# EAGLE design master_node_v0.1 (EAGLE 9.6.2)
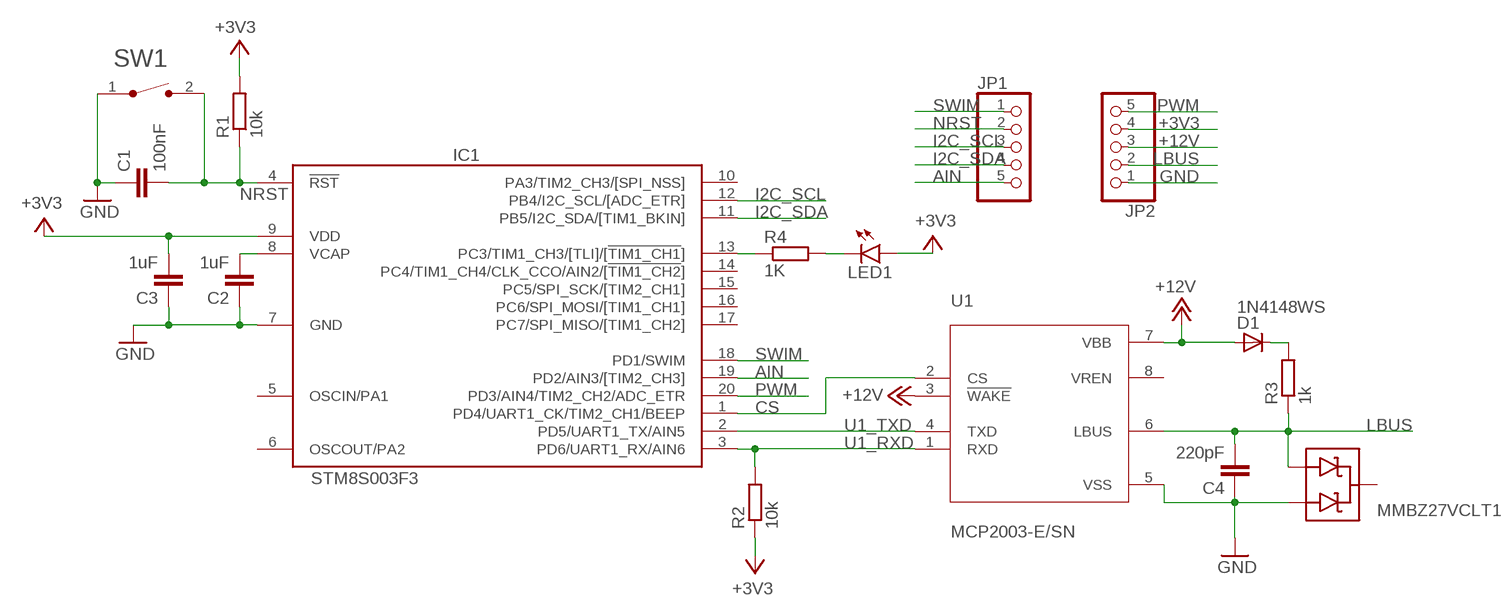
[diagram p0: schematic, sheet 1]

## Parts
C1  100nF  C-EUC0603  [C0603]
C2  1uF  C-EUC0603  [C0603]
C3  1uF  C-EUC0603  [C0603]
C4  220pF  C-EUC0603  [C0603]
D1  1N4148WS  [SOD323]
D2  MMBZ27VCLT1  [SOT23-3]
IC1  STM8S003F3  [TSSOP20]
JP1  PINHD-1X5  [1X05]
JP2  PINHD-1X5  [1X05]
LED1  LEDCHIP-LED0603  [CHIP-LED0603]
R1  10k  R-EU_R0603  [R0603]
R2  10k  R-EU_R0603  [R0603]
R3  1k  R-EU_R0603  [R0603]
R4  1K  R-EU_R0603  [R0603]
SW1  FSMSM  [TE_FSMSM]
U1  MCP2003-E/SN  [SOIC127P600X175-8N]

## Nets
+3V3: C3.2 IC1.9(VDD) JP2.4 LED1.A R1.2 R2.1
+12V: D1.A JP2.3 U1.3(!WAKE) U1.7(VBB)
AIN: IC1.19(PD2/AIN3/[TIM2_CH3]) JP1.5
CS: IC1.1(PD4/UART1_CK/TIM2_CH1/BEEP) U1.2(CS)
GND: C1.1 C2.1 C3.1 C4.1 D2.1(A1) IC1.7(GND) JP2.1 SW1.1 U1.5(VSS)
I2C_SCL: IC1.12(PB4/I2C_SCL/[ADC_ETR]) JP1.3
I2C_SDA: IC1.11(PB5/I2C_SDA/[TIM1_BKIN]) JP1.4
LBUS: C4.2 D2.2(A2) JP2.2 R3.1 U1.6(LBUS)
N$1: D1.C R3.2
N$2: C2.2 IC1.8(VCAP)
N$3: LED1.C R4.2
N$4: IC1.13(PC3/TIM1_CH3/[TLI]/[!TIM1_CH1!]) R4.1
NRST: C1.2 IC1.4(!RST) JP1.2 R1.1 SW1.2
PWM: IC1.20(PD3/AIN4/TIM2_CH2/ADC_ETR) JP2.5
SWIM: IC1.18(PD1/SWIM) JP1.1
U1_RXD: IC1.3(PD6/UART1_RX/AIN6) R2.2 U1.1(RXD)
U1_TXD: IC1.2(PD5/UART1_TX/AIN5) U1.4(TXD)
Unconnected: D2.3(C) IC1.5(OSCIN/PA1) IC1.6(OSCOUT/PA2) IC1.10(PA3/TIM2_CH3/[SPI_NSS]) IC1.14(PC4/TIM1_CH4/CLK_CCO/AIN2/[!TIM1_CH2!]) IC1.15(PC5/SPI_SCK/[TIM2_CH1]) IC1.16(PC6/SPI_MOSI/[TIM1_CH1]) IC1.17(PC7/SPI_MISO/[TIM1_CH2]) U1.8(VREN)

## Library data of the parts
C1-C4 = rcl:C-EU: CAPACITOR, European symbol; SPICEPREFIX: C
D1 = opaygolink:1N4148WS: http://octopart.com/1n4148ws-fairchild+semiconductor-7851016 Check prices <https://pricing.snapeda.com/parts/1N4148WS/ON%20Semiconductor/view-part?ref=eda>; AVAILABILITY: Good; DESCRIPTION: Diode Standard 75V 150mA Surface Mount SOD-323F; MF: ON Semiconductor; MP: 1N4148WS; PACKAGE: SOD-323FL-2 ON Semiconductor; PRICE: None; PURCHASE-URL: https://pricing.snapeda.com/search/part/1N4148WS/?ref=eda
D2 = opaygolink:MMBZ27VCLT1: 40W Zener-diode transient voltage suppressor (ESD protection); AVAILABILITY: Unavailable; DESCRIPTION: 38V Clamp 1A Ipp Tvs Diode Surface Mount SOT-23-3 _TO-236_; MF: ON Semiconductor; MP: MMBZ27VCLT1; PACKAGE: SOT-23-3 ON Semiconductor; PRICE: None; SPICEPREFIX: U
IC1 = opaygolink:STM8S003: Value line, 16 MHz STM8S 8-bit MCU, 8 Kbytes Flash, 128 bytes data EEPROM, 10-bit ADC, 3 timers, UART, SPI, I2C
JP1 JP2 = opaygolink:PINHD-1X5: PIN HEADER
LED1 = led:LED: LED OSRAM: - CHIPLED LG R971, LG N971, LY N971, LG Q971, LY Q971, LO R971, LY R971 LH N974, LH R974 LS Q976, LO Q976, LY Q976 LO Q996 - Hyper CHIPLED LW Q18S LB Q993, LB Q99A, LB R99A - SideLED LS A670, LO A670, LY A670, LG A670, LP A670 LB A673, LV A673, LT A673, LW A673 LH A674 LY A675 LS A676, LA A676, LO A676, LY A676, LW A676 LS A679, LY A679, LG A679 - Hyper Micro SIDELED® LS Y876, LA Y876, LO Y876, LY Y876 LT Y87S - SmartLED LW L88C, LW L88S LB L89C, LB L89S, LG L890 LS L89K, LO L89K, LY L89K LS L896, LA L896, LO L896, LY L896 - TOPLED LS T670, LO T670, LY T670, LG T670, LP T670 LSG T670, LSP T670, LSY T670, LOP T670, LYG T670 LG T671, LOG T671, LSG T671 LB T673, LV T673, LT T673, LW T673 LH T674 LS T676, LA T676, LO T676, LY T676, LB T676, LH T676, LSB T676, LW T676 LB T67C, LV T67C, LT T67C, LS T67K, LO T67K, LY T67K, LW E67C LS E67B, LA E67B, LO E67B, LY E67B, LB E67C, LV E67C, LT E67C LW T67C LS T679, LY T679, LG T679 LS T770, LO T770, LY T770, LG T770, LP T770 LB T773, LV T773, LT T773, LW T773 LH T774 LS E675, LA E675, LY E675, LS T675 LS T776, LA T776, LO T776, LY T776, LB T776 LHGB T686 LT T68C, LB T68C - Hyper Mini TOPLED® LB M676 - Mini TOPLED Santana® LG M470 LS M47K, LO M47K, LY M47K Source: http://www.osram.convergy.de LUXEON: - LUMILED® LXK2-PW12-R00, LXK2-PW12-S00, LXK2-PW14-U00, LXK2-PW14-V00 LXK2-PM12-R00, LXK2-PM12-S00, LXK2-PM14-U00 LXK2-PE12-Q00, LXK2-PE12-R00, LXK2-PE12-S00, LXK2-PE14-T00, LXK2-PE14-U00 LXK2-PB12-K00, LXK2-PB12-L00, LXK2-PB12-M00, LXK2-PB14-N00, LXK2-PB14-P00, LXK2-PB14-Q00 LXK2-PR12-L00, LXK2-PR12-M00, LXK2-PR14-Q00, LXK2-PR14-R00 LXK2-PD12-Q00, LXK2-PD12-R00, LXK2-PD12-S00 LXK2-PH12-R00, LXK2-PH12-S00 LXK2-PL12-P00, LXK2-PL12-Q00, LXK2-PL12-R00 Source: www.luxeon.com KINGBRIGHT: KA-3528ASYC Source: www.kingbright.com
R1-R4 = rcl:R-EU_: RESISTOR, European symbol; SPICEPREFIX: R
SW1 = opaygolink:FSMSM: Switch Tactile OFF (ON) SPST Rectangular Button Gull Wing 0.05A 12VDC SMD Loose Piece; AVAILABILITY: Unavailable; COMMENT: 1437566-3; CONFIGURATION_POLE-THROW: Single Pole - Single Throw; CONTACT_CURRENT_RATING: 50 mA; DESCRIPTION: Tactile Switch SPST-NO Top Actuated Surface Mount; MF: TE Connectivity; MP: FSMSM; PACKAGE: None; PRICE: None; TE_PURCHASE_URL: https://www.te.com/usa-en/product-1437566-3.html?te_bu=Cor&te_type=disp&te_campaign=seda_glo_cor-seda-global-disp-prtnr-fy19-seda-model-bom-cta_sma-317_1&elqCampaignId=32493
U1 = opaygolink:MCP2003-E/SN: MCP2003 Series 6 to 27 V Bidirectional LIN J2602 Transceiver SMT - SOIC-8; AVAILABILITY: Unavailable; DESCRIPTION: 1/1 Transceiver Half LINbus 8-SOIC; MF: Microchip; MP: MCP2003-E/SN; PACKAGE: SO-8 Microchip; PRICE: None

## Board
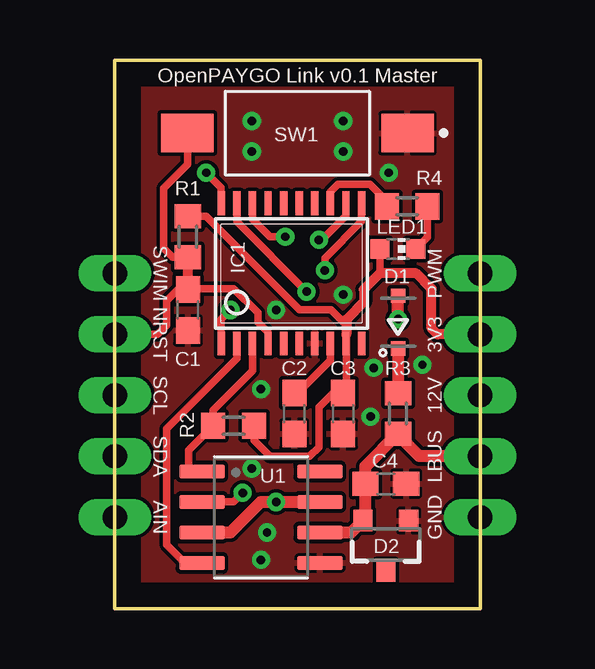
[diagram p1: board, top side]
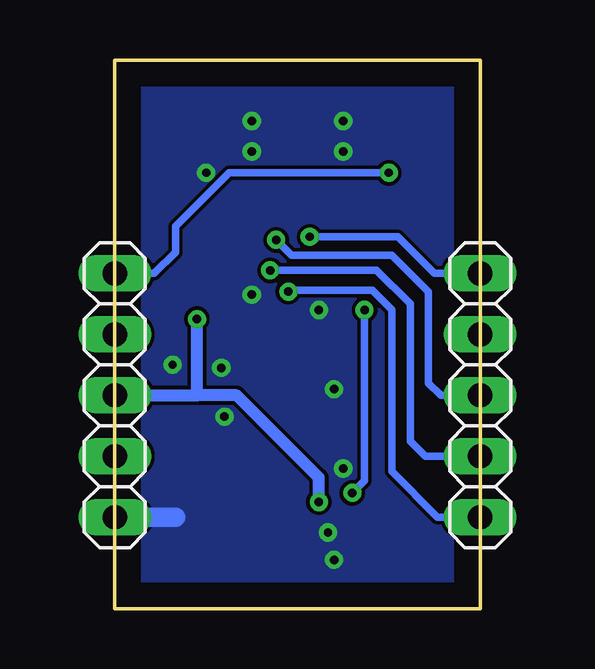
[diagram p2: board, bottom side, seen from below]

Size 15.24 x 22.86 mm. Coordinates in mm from the lower left corner, seen from the top.
Outline: 0,22.86 0,0 15.24,0 15.24,22.86 0,22.86
Copper layers (1*16): Top 0.035mm / dielectric 1.5mm / Bottom 0.035mm
Design rules "default *": minimum track width 6mil, minimum drill 0.35mm, track to track 6mil, track to pad 6mil, pad to pad 6mil, via to via 6mil, smd to smd 6mil, copper to edge 40mil, drill to drill 6mil, minimum pad ring 10mil, minimum via ring 8mil, stop-mask expansion 4mil, vias tented up to drill 0mil, thermal gap 5mil

### Footprints (pad centres in the part's own frame; a part is rotated, then mirrored left to right if it is on the bottom)
C0603 = smd 1.1 x 1: 1 -0.85,0; 2 0.85,0
SOD323 = smd 0.6 x 0.6: A 1.1,0; C -1.1,0
SOT23-3 = smd 0.8 x 0.9: 1 -0.95,-1; 2 0.95,-1; 3 0,1.1
TSSOP20 = smd 0.305 x 0.991: 1 -2.925,-2.918; 2 -2.275,-2.918; 3 -1.625,-2.918; 4 -0.975,-2.918; 5 -0.325,-2.918; 6 0.325,-2.918; 7 0.975,-2.918; 8 1.625,-2.918; 9 2.275,-2.918; 10 2.925,-2.918; 11 2.925,2.918; 12 2.275,2.918; 13 1.625,2.918; 14 0.975,2.918; 15 0.325,2.918; 16 -0.325,2.918; 17 -0.975,2.918; 18 -1.625,2.918; 19 -2.275,2.918; 20 -2.925,2.918
1X05 = drill 1.016 long: 1 -5.08,0; 2 -2.54,0; 3 0,0; 4 2.54,0; 5 5.08,0
CHIP-LED0603 = smd 0.8 x 0.8: A 0,-0.75; C 0,0.75
R0603 = smd 1 x 1.1: 1 -0.85,0; 2 0.85,0
TE_FSMSM = smd 2.19 x 1.6: 1 -4.59,0; 2 4.59,0
SOIC127P600X175-8N = smd 1.9 x 0.6: 1 -2.455,1.905; 2 -2.455,0.635; 3 -2.455,-0.635; 4 -2.455,-1.905; 5 2.455,-1.905; 6 2.455,-0.635; 7 2.455,0.635; 8 2.455,1.905

### Placement (x,y rotation side)
C1  3.05,12.45 90 top
C2  7.49,8.13 90 top
C3  9.53,8.13 90 top
C4  11.3,5.21 180 top
D1  11.81,11.94 90 top
D2  11.3,2.67 180 top
IC1  7.37,13.97 0 top
JP1  0,8.89 270 bottom
JP2  15.24,8.89 90 bottom
LED1  11.81,14.99 270 top
R1  3.05,15.49 90 top
R2  4.95,7.62 180 top
R3  11.81,8.13 90 top
R4  12.19,16.76 0 top
SW1  7.62,19.81 180 top
U1  6.1,3.81 0 top

### Tracks (layer width: path | path; a pad name or v marks a point on that pad's centre or on a via)
+3V3
  Top 0.305: 9.65,11.04 9.65,9.11 C3.2 9.11,8.98 8.51,8.38 8.51,6.73 8.13,6.35 6.48,6.35 5.8,7.02 R2.1 | 9.65,11.04 IC1.9 | R1.2 3.81,16.34 7.71,12.45 9.02,12.45 9.65,11.81 9.65,11.43 9.65,11.04 | LED1.A 11.06,13.98 11.05,13.97
  Top 0.406: C3.2 9.53,9.14 | 9.65,11.43 9.65,12.04 10.39,12.78 10.39,13.31 11.05,13.97 12.57,13.97 13.21,13.34 13.21,11.68 13.46,11.43 JP2.4
+12V  (via drill 0.35)
  Top 0.508: U1.7 v6.73,4.45 6.1,4.45 4.83,3.17 U1.3 | v11.81,12.06 D1.A
  Bottom 0.508: 11.81,8.89 v11.81,12.06 | JP2.3 11.81,8.89 | v6.73,4.45 6.73,5.46 10.16,8.89 11.81,8.89
AIN  (via drill 0.35)
  Top 0.305: IC1.19 5.09,16.12 v8,13.21
  Bottom 0.305: v8,13.21 8,13.26 4.5,13.26 3.68,12.45 3.68,5.71 1.78,3.81 JP1.5
CS  (via drill 0.35)
  Top 0.305: IC1.1 4.44,12.06 v4.83,12.45 | U1.2 4.95,4.45 v5.33,4.83
  Bottom 0.305: v4.83,12.45 4.83,5.33 v5.33,4.83
GND  (via drill 0.35)
  Bottom 0.813: JP2.1 12.7,3.81
  other vias: 6.1,9.14 6.73,12.45 6.1,2.03 6.35,3.17 5.71,19.05 9.53,19.05 9.53,20.32 5.71,20.32 11.43,18.16 9.53,13.08 12.83,10.16 10.79,10.03 10.67,8 5.71,5.84
  pour Top: 0,0 15.24,0 15.24,22.86 0,22.86
  pour Bottom: 0,0 15.24,0 15.24,22.86 0,22.86
I2C_SCL  (via drill 0.35)
  Top 0.305: v8.51,15.37 8.64,15.37 9.64,16.37 IC1.12
  Bottom 0.305: v8.51,15.37 7.87,14.73 3.68,14.73 2.16,13.21 2.16,9.4 1.65,8.89 JP1.3
I2C_SDA  (via drill 0.35)
  Top 0.305: v8.76,14.1 8.76,14.61 10.29,16.13 IC1.11
  Bottom 0.305: v8.76,14.1 4.32,14.1 2.92,12.7 2.92,6.99 2.29,6.35 JP1.4
LBUS
  Top 0.508: U1.6 9.86,3.17 D2.2 10.45,3.77 C4.2 10.45,5.92 R3.1 11.81,7.24 12.7,6.35 JP2.2
N$1
  Top 0.508: D1.C R3.2
N$2
  Top 0.305: IC1.8 8.99,10.35 7.62,8.98 C2.2
N$3
  Top 0.305: LED1.C 13.04,15.47 R4.2
N$4
  Top 0.305: IC1.13 8.99,17.37 9.31,17.69 10.63,17.69 11.34,16.98 R4.1
NRST
  Top 0.305: R1.1 2.41,14.64 2.03,15.03 2.03,17.53 3.03,18.52 SW1.2 | IC1.4 6.39,11.52 5.97,11.94 5.97,12.32 4.95,13.34 3.05,13.34 2.67,13.34 2.16,12.83 2.16,11.81 1.78,11.43 JP1.2
  Top 0.406: C1.2 3.05,13.34 R1.1
PWM  (via drill 0.35)
  Top 0.305: 4.44,17.32 IC1.20 4.44,17.53 v3.81,18.16
  Bottom 0.305: v3.81,18.16 10.46,18.16 12.7,15.93 12.7,14.86 13.59,13.97 JP2.5
SWIM  (via drill 0.35)
  Top 0.305: IC1.18 5.74,16.23 6.48,15.49 v7.11,15.49
  Bottom 0.305: v7.11,15.49 3.43,15.49 1.9,13.97 JP1.1
U1_RXD
  Top 0.305: 4.4,5.71 U1.1 3.09,5.71 3.09,6.6 R2.2 4.1,8.27 5.74,9.91 IC1.3
U1_TXD
  Top 0.305: U1.4 2.92,1.91 2.16,2.67 2.16,7.49 5.09,10.43 IC1.2

### Text on the board
tNames: OpenPAYGO Link v0.1 Master | SWIM | PWM | NRST | 3V3 | SCL | 12V | SDA | LBUS | AIN | GND